# Altium schematic sheet IO.SchDoc: Input/Output
size A3; DrawnBy: Evan Peters; Revision: 1; SheetNumber: 3; SheetTotal: 4
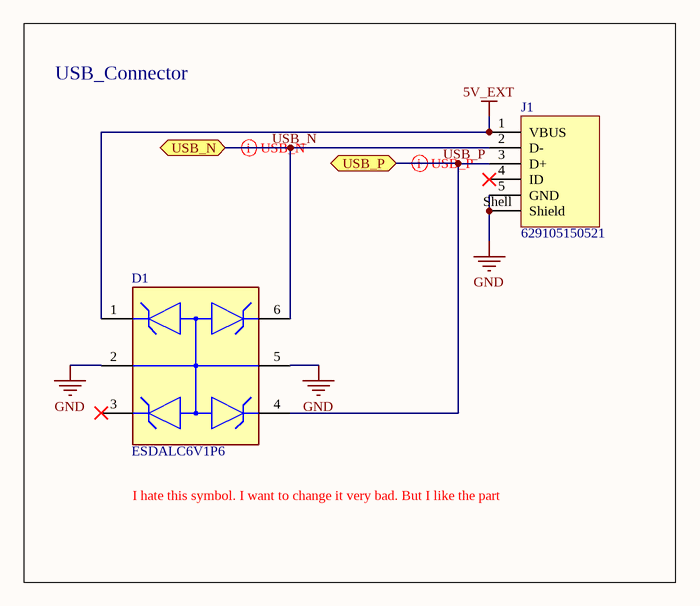
[diagram p0: IO.SchDoc]

## Parts
D1  ESDALC6V1P6  [FP-SOT-666IP-MFG]
J1  629105150521  [629105150521]

## Blocks framed on the sheet
USB_Connector: D1 J1

## Ports
USB_N (bidir, see Main[5B], MCU_STM32[2C]), USB_P (bidir, see Main[5B], MCU_STM32[2C])

## Nets
5V_EXT: D1.1 J1.1(VBUS)
GND: D1.2 D1.5 J1.5(GND) J1.Shell(Shield)
USB_N: D1.6 J1.2(D-) ; port USB_N
USB_P: D1.4 J1.3(D+) ; port USB_P

Not connected (* = marked no-connect by the designer): D1 3*; J1 4(ID)*

## Layout directives
differential pair: USB_N, USB_P

## Notes on the sheet
- I hate this symbol. I want to change it very bad. But I like the part

## Library data of the parts
D1 = CMP-12225-000016-1: TVS DIODE 3V SOT666IP; Manufacturer: STMicroelectronics; Peak Pulse Power: 30W; Capacitance: 7.5pF; Value: 7.5pF; Number Of Channels: 4; Description: 4 Channel 6.1V Uni-Directional Transil ESD Protection - SOT-666IP; Max Junction Temp: +150°C; Breakdown Voltage: 6.1V; Direction: Unidirectional; Device Class L1: Circuit Protection; Reverse Standoff Voltage: 3V; Package: SOT-666IP; Device Class L3: unset; Temperature Range Low: -40°C; ComponentLink2Description: Datasheet; Height: 0.62mm; ComponentLink2URL: https://www.st.com/resource/en/datasheet/esdalc6v1px.pdf; Category: Diode; RoHS: TRUE; Device Class L2: TVS Diodes; Mouser Description: ESDALC Series 4 Channel 6.1V Uni-Directional Transil? ESD Protection - SOT-666IP; Lead Free: Yes; Manufacturer Part Number: ESDALC6V1P6; Temperature Range High: +150°C; Temperature: -40°C to +150°C; Digikey Description: TVS DIODE 3V SOT666IP; Automotive: No; Octopart: https://octopart.com/esdalc6v1p6-stmicroelectronics-347727
J1 = CMP-1502-03252-3: NexarPartId: 52645113; Number of Contacts: 5; Contact Resistance: 30mΩ; Connector Type: USB; Voltage Rating: 30V; Current Rating: 3A; USB Standard: USB 2.0; Gender: Receptacle; Insulation Resistance: 1GΩ; Height: 2.86mm; REACH SVHC: Unknown; RoHS: Compliant; Features: Shielded; Termination: SMD/SMT; Number of Pins: 5; Contact Plating: Gold; Packaging: Tape and Reel; Contact Material: Gold; Mount: Horizontal, Surface Mount; Max Operating Temperature: 85°C; Lead Free: Lead Free; Min Operating Temperature: -40°C; Orientation: Horizontal; Operating Supply Voltage: 30V